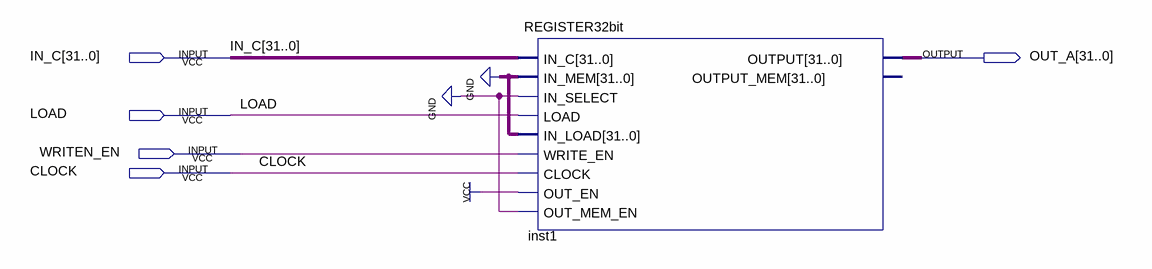
[diagram p0: schematic sheet]
// Quartus schematic H.bdf as structural Verilog: 1 symbols, 5 pins
module H (
  input  [31:0] IN_C,
  input  LOAD,
  input  WRITEN_EN,
  input  CLOCK,
  output [31:0] OUT_A
);

  REGISTER32bit inst1 (
    .IN_C(IN_C), .IN_MEM({32{1'b0}}), .IN_SELECT(1'b0), .LOAD(LOAD), .IN_LOAD({32{1'b0}}),
    .WRITE_EN(WRITEN_EN), .CLOCK(CLOCK), .OUT_EN(1'b1), .OUT_MEM_EN(1'b0), .OUTPUT(OUT_A));  // open: OUTPUT_MEM
endmodule
